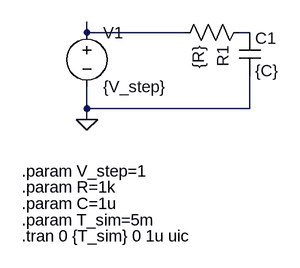
[diagram p0: schematic rc_step.asc]
rc_step.asc, the LTspice schematic file:
Version 4
SHEET 1 880 680
WIRE 96 96 96 80
WIRE 240 96 96 96
WIRE 336 96 320 96
WIRE 96 208 96 176
WIRE 336 208 336 160
WIRE 336 208 96 208
WIRE 96 224 96 208
FLAG 96 224 0
SYMBOL voltage 96 80 R0
SYMATTR InstName V1
SYMATTR Value {V_step}
SYMBOL res 336 80 R90
SYMATTR InstName R1
SYMATTR Value {R}
SYMBOL cap 320 96 R0
SYMATTR InstName C1
SYMATTR Value {C}
SYMATTR SpiceLine ic=0
TEXT 0 300 Left 2 !.param V_step=1
TEXT 0 324 Left 2 !.param R=1k
TEXT 0 348 Left 2 !.param C=1u
TEXT 0 372 Left 2 !.param T_sim=5m
TEXT 0 396 Left 2 !.tran 0 {T_sim} 0 1u uic

The netlist it stands for:
* rc_step.asc
V1 N001 0 {V_step}
R1 N002 N001 {R}
C1 N002 0 {C} ic=0
.param V_step=1
.param R=1k
.param C=1u
.param T_sim=5m
.tran 0 {T_sim} 0 1u uic
.backanno
.end